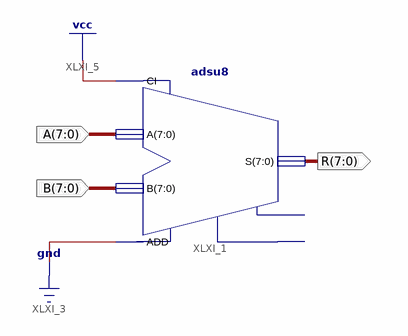
[diagram p0: schematic sheet 1]
// Xilinx ISE schematic Minus.sch (spartan6) as structural Verilog: 1 symbols, 3 ports
module Minus (
  input  [7:0] A,
  input  [7:0] B,
  output [7:0] R
);

  adsu8 XLXI_1 (.A(A), .ADD(1'b0), .B(B), .CI(1'b1), .S(R));  // open: CO, OFL
endmodule
